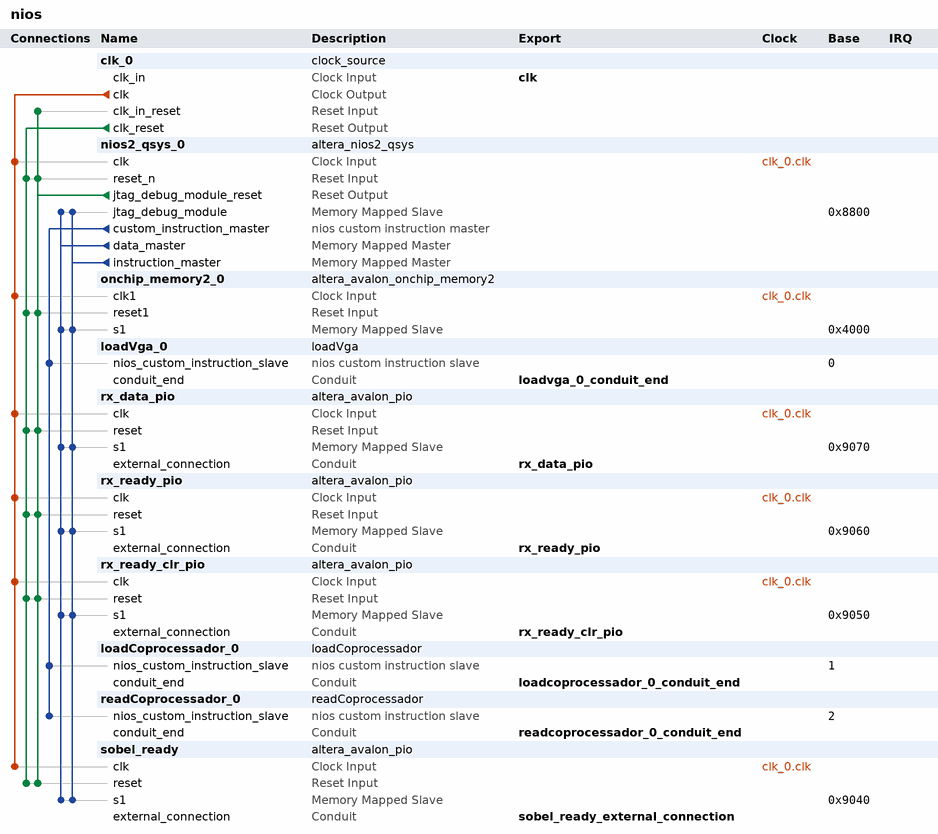
[diagram p0: system contents]
# Platform Designer (Qsys) system nios, Cyclone IV E EP4CE6E22C7
# Parameters at their usual value, and those the tool derives, are not listed.
package require -exact qsys 13.0.1.99.2
create_system nios
set_project_property DEVICE_FAMILY {Cyclone IV E}
set_project_property DEVICE EP4CE6E22C7

add_instance clk_0 clock_source 13.0
set_instance_parameter_value clk_0 clockFrequency 50000000

add_instance nios2_qsys_0 altera_nios2_qsys 13.0
set_instance_parameter_value nios2_qsys_0 resetSlave onchip_memory2_0.s1
set_instance_parameter_value nios2_qsys_0 mmu_TLBMissExcSlave None
set_instance_parameter_value nios2_qsys_0 exceptionSlave onchip_memory2_0.s1
set_instance_parameter_value nios2_qsys_0 breakSlave nios2_qsys_0.jtag_debug_module
set_instance_parameter_value nios2_qsys_0 impl Tiny
set_instance_parameter_value nios2_qsys_0 icache_size 4096

add_instance onchip_memory2_0 altera_avalon_onchip_memory2 13.0.1.99.2
set_instance_parameter_value onchip_memory2_0 dataWidth 32
set_instance_parameter_value onchip_memory2_0 dualPort false
set_instance_parameter_value onchip_memory2_0 initMemContent true
set_instance_parameter_value onchip_memory2_0 initializationFileName onchip_mem.hex
set_instance_parameter_value onchip_memory2_0 memorySize 16384

add_instance loadVga_0 loadVga 1.0

add_instance rx_data_pio altera_avalon_pio 13.0.1.99.2
set_instance_parameter_value rx_data_pio direction Input
set_instance_parameter_value rx_data_pio width 8

add_instance rx_ready_pio altera_avalon_pio 13.0.1.99.2
set_instance_parameter_value rx_ready_pio direction Input
set_instance_parameter_value rx_ready_pio width 1

add_instance rx_ready_clr_pio altera_avalon_pio 13.0.1.99.2
set_instance_parameter_value rx_ready_clr_pio direction Output
set_instance_parameter_value rx_ready_clr_pio width 1

add_instance loadCoprocessador_0 loadCoprocessador 1.0

add_instance readCoprocessador_0 readCoprocessador 1.0

add_instance sobel_ready altera_avalon_pio 13.0.1.99.2
set_instance_parameter_value sobel_ready direction Input
set_instance_parameter_value sobel_ready width 1

# connections
add_connection clk_0.clk nios2_qsys_0.clk clock
add_connection clk_0.clk onchip_memory2_0.clk1 clock
add_connection clk_0.clk rx_data_pio.clk clock
add_connection clk_0.clk rx_ready_clr_pio.clk clock
add_connection clk_0.clk rx_ready_pio.clk clock
add_connection clk_0.clk sobel_ready.clk clock
add_connection clk_0.clk_reset nios2_qsys_0.reset_n reset
add_connection clk_0.clk_reset onchip_memory2_0.reset1 reset
add_connection clk_0.clk_reset rx_data_pio.reset reset
add_connection clk_0.clk_reset rx_ready_clr_pio.reset reset
add_connection clk_0.clk_reset rx_ready_pio.reset reset
add_connection clk_0.clk_reset sobel_ready.reset reset
add_connection nios2_qsys_0.jtag_debug_module_reset clk_0.clk_in_reset reset
add_connection nios2_qsys_0.jtag_debug_module_reset nios2_qsys_0.reset_n reset
add_connection nios2_qsys_0.jtag_debug_module_reset onchip_memory2_0.reset1 reset
add_connection nios2_qsys_0.jtag_debug_module_reset rx_data_pio.reset reset
add_connection nios2_qsys_0.jtag_debug_module_reset rx_ready_clr_pio.reset reset
add_connection nios2_qsys_0.jtag_debug_module_reset rx_ready_pio.reset reset
add_connection nios2_qsys_0.jtag_debug_module_reset sobel_ready.reset reset
add_connection nios2_qsys_0.data_master nios2_qsys_0.jtag_debug_module avalon
set_connection_parameter_value nios2_qsys_0.data_master/nios2_qsys_0.jtag_debug_module baseAddress 0x8800
add_connection nios2_qsys_0.data_master onchip_memory2_0.s1 avalon
set_connection_parameter_value nios2_qsys_0.data_master/onchip_memory2_0.s1 baseAddress 0x4000
add_connection nios2_qsys_0.data_master rx_data_pio.s1 avalon
set_connection_parameter_value nios2_qsys_0.data_master/rx_data_pio.s1 baseAddress 0x9070
add_connection nios2_qsys_0.data_master rx_ready_clr_pio.s1 avalon
set_connection_parameter_value nios2_qsys_0.data_master/rx_ready_clr_pio.s1 baseAddress 0x9050
add_connection nios2_qsys_0.data_master rx_ready_pio.s1 avalon
set_connection_parameter_value nios2_qsys_0.data_master/rx_ready_pio.s1 baseAddress 0x9060
add_connection nios2_qsys_0.data_master sobel_ready.s1 avalon
set_connection_parameter_value nios2_qsys_0.data_master/sobel_ready.s1 baseAddress 0x9040
add_connection nios2_qsys_0.instruction_master nios2_qsys_0.jtag_debug_module avalon
set_connection_parameter_value nios2_qsys_0.instruction_master/nios2_qsys_0.jtag_debug_module baseAddress 0x8800
add_connection nios2_qsys_0.instruction_master onchip_memory2_0.s1 avalon
set_connection_parameter_value nios2_qsys_0.instruction_master/onchip_memory2_0.s1 baseAddress 0x4000
add_connection nios2_qsys_0.instruction_master rx_data_pio.s1 avalon
set_connection_parameter_value nios2_qsys_0.instruction_master/rx_data_pio.s1 baseAddress 0x9070
add_connection nios2_qsys_0.instruction_master rx_ready_clr_pio.s1 avalon
set_connection_parameter_value nios2_qsys_0.instruction_master/rx_ready_clr_pio.s1 baseAddress 0x9050
add_connection nios2_qsys_0.instruction_master rx_ready_pio.s1 avalon
set_connection_parameter_value nios2_qsys_0.instruction_master/rx_ready_pio.s1 baseAddress 0x9060
add_connection nios2_qsys_0.instruction_master sobel_ready.s1 avalon
set_connection_parameter_value nios2_qsys_0.instruction_master/sobel_ready.s1 baseAddress 0x9040
add_connection nios2_qsys_0.custom_instruction_master loadCoprocessador_0.nios_custom_instruction_slave nios_custom_instruction
set_connection_parameter_value nios2_qsys_0.custom_instruction_master/loadCoprocessador_0.nios_custom_instruction_slave CIName loadcoprocessador_0
set_connection_parameter_value nios2_qsys_0.custom_instruction_master/loadCoprocessador_0.nios_custom_instruction_slave baseAddress 1
add_connection nios2_qsys_0.custom_instruction_master loadVga_0.nios_custom_instruction_slave nios_custom_instruction
set_connection_parameter_value nios2_qsys_0.custom_instruction_master/loadVga_0.nios_custom_instruction_slave CIName loadvga_0
set_connection_parameter_value nios2_qsys_0.custom_instruction_master/loadVga_0.nios_custom_instruction_slave baseAddress 0
add_connection nios2_qsys_0.custom_instruction_master readCoprocessador_0.nios_custom_instruction_slave nios_custom_instruction
set_connection_parameter_value nios2_qsys_0.custom_instruction_master/readCoprocessador_0.nios_custom_instruction_slave CIName readcoprocessador_0
set_connection_parameter_value nios2_qsys_0.custom_instruction_master/readCoprocessador_0.nios_custom_instruction_slave baseAddress 2

# exported interfaces
add_interface clk clock sink
set_interface_property clk EXPORT_OF clk_0.clk_in
add_interface loadvga_0_conduit_end conduit end
set_interface_property loadvga_0_conduit_end EXPORT_OF loadVga_0.conduit_end
add_interface rx_data_pio conduit end
set_interface_property rx_data_pio EXPORT_OF rx_data_pio.external_connection
add_interface rx_ready_pio conduit end
set_interface_property rx_ready_pio EXPORT_OF rx_ready_pio.external_connection
add_interface rx_ready_clr_pio conduit end
set_interface_property rx_ready_clr_pio EXPORT_OF rx_ready_clr_pio.external_connection
add_interface loadcoprocessador_0_conduit_end conduit end
set_interface_property loadcoprocessador_0_conduit_end EXPORT_OF loadCoprocessador_0.conduit_end
add_interface readcoprocessador_0_conduit_end conduit end
set_interface_property readcoprocessador_0_conduit_end EXPORT_OF readCoprocessador_0.conduit_end
add_interface sobel_ready_external_connection conduit end
set_interface_property sobel_ready_external_connection EXPORT_OF sobel_ready.external_connection

set_interconnect_requirement {$system} qsys_mm.clockCrossingAdapter HANDSHAKE
set_interconnect_requirement {$system} qsys_mm.maxAdditionalLatency 1

save_system nios.qsys
